# Altium project PCB_Project.PrjPcb
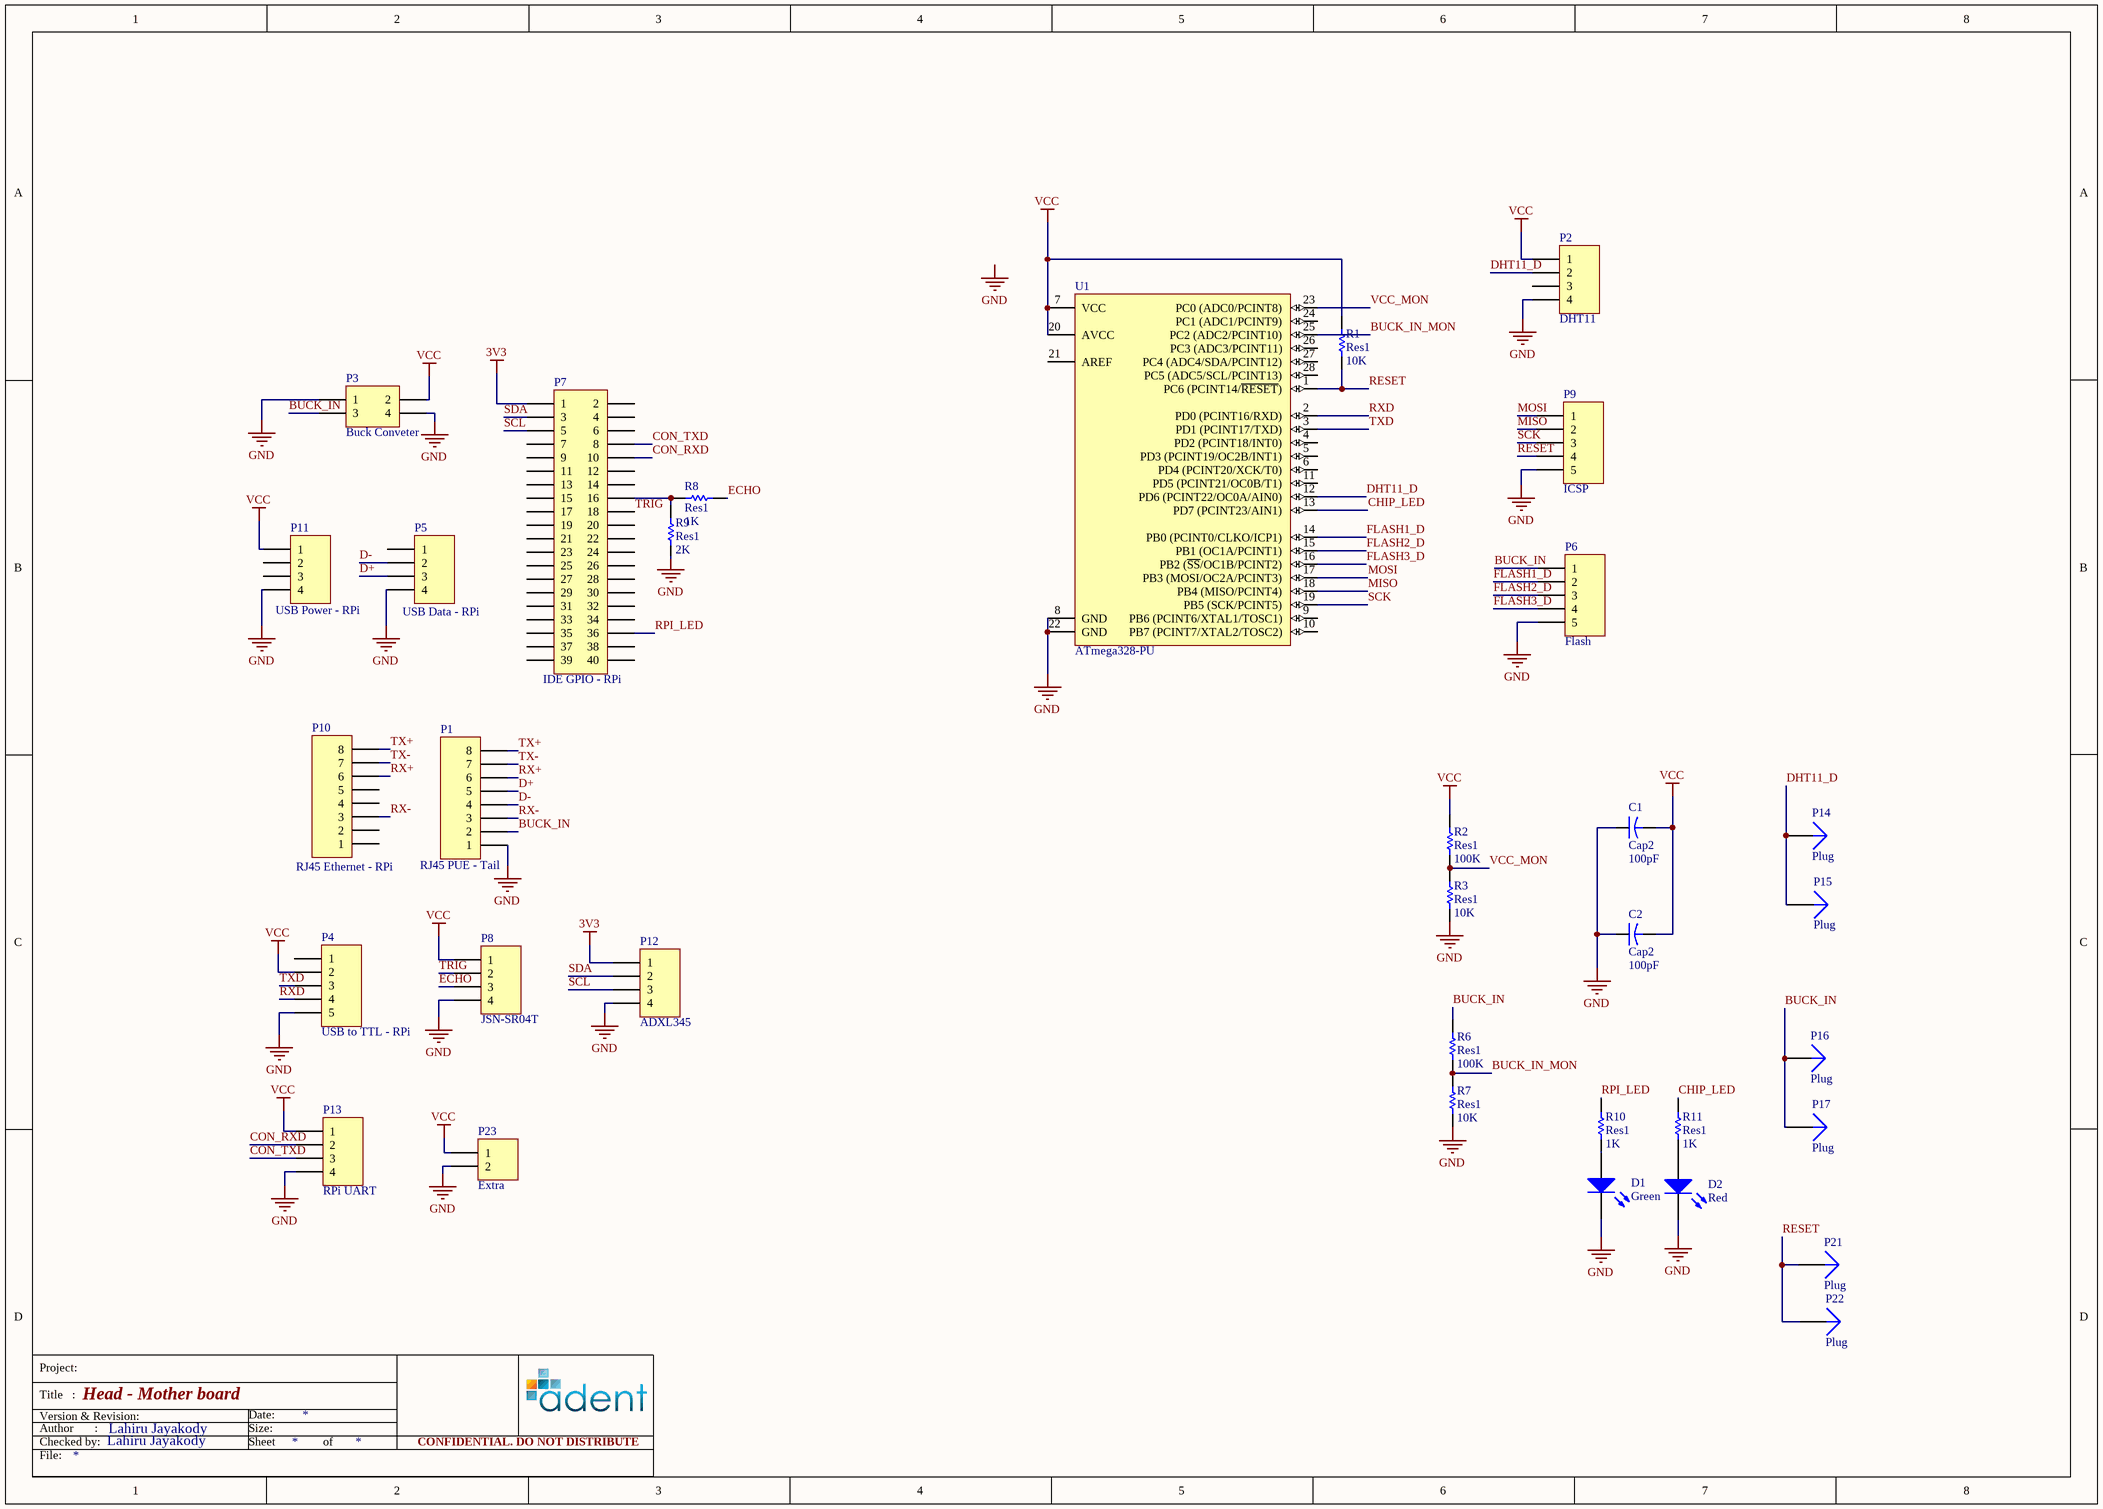
[diagram p0: HeadBoard.SchDoc]
1 sheet, 34 parts. Net scope: global (net labels, ports and power ports of the same name join across sheets).
Board file: HeadBoard.PcbDoc

## Sheet HeadBoard.SchDoc
size A3; SheetTitle: Head - Mother board; AuthorName: Lahiru Jayakody; CheckedByName: Lahiru Jayakody; PageSetup: Record=PageOptions|CenterHorizontal=True|CenterVertical=True|PrintScale=1.53|XCorrection=1.00|YCorrection=1.00|PrintKind=0|BorderSize=5000000|LeftOffset=0|BottomOffset=0|Orientation=1|PaperLength=1000|PaperWidth=1000|Scale=100|PaperSource=7|PrintQuality=-3|MediaType=1|DitherType=10|PrintScaleMode=1|PaperKind=B5 (JIS)|PaperIndex=13

### Parts
C1  Cap2  value 100pF  [CAPR5-4X5]
C2  Cap2  value 100pF  [CAPR5-4X5]
D1  Green  [LED-1]
D2  Red  [LED-1]
P1  RJ45 PUE - Tail  [RJ45]
P2  DHT11  [HDR1X4]
P3  Buck Conveter  [PWR_HEADER]
P4  USB to TTL - RPi  [HDR1X5]
P5  USB Data - RPi  [USB_Female]
P6  Flash  [HDR1X5]
P7  IDE GPIO - RPi  [HDR2X20]
P8  JSN-SR04T  [HDR1X4]
P9  ICSP  [HDR1X5]
P10  RJ45 Ethernet - RPi  [RJ45]
P11  USB Power - RPi  [USB_Female]
P12  ADXL345  [HDR1X4]
P13  RPi UART  [HDR1X4]
P14  Plug  [PIN1]
P15  Plug  [PIN1]
P16  Plug  [PIN1]
P17  Plug  [PIN1]
P21  Plug  [PIN1]
P22  Plug  [PIN1]
P23  Extra  [HDR1X2]
R1  Res1  value 10K  [AXIAL-0.3]
R2  Res1  value 100K  [AXIAL-0.3]
R3  Res1  value 10K  [AXIAL-0.3]
R6  Res1  value 100K  [AXIAL-0.3]
R7  Res1  value 10K  [AXIAL-0.3]
R8  Res1  value 1K  [AXIAL-0.3]
R9  Res1  value 2K  [AXIAL-0.3]
R10  Res1  value 1K  [AXIAL-0.3]
R11  Res1  value 1K  [AXIAL-0.3]
U1  ATmega328-PU  [28P3]

### Nets
3V3: P7.1 P12.1
GND: C1.1 C2.1 D1.2(K) D2.2(K) P1.1 P2.4 P3.1 P3.4 P4.5 P5.4 P6.5 P8.4 P9.5 P11.4 P12.4 P13.4 P23.2 R3.1 R7.1 R9.1 U1.8(GND) U1.22(GND)
VCC: C1.2 C2.2 P2.1 P3.2 P4.2 P8.1 P11.1 P13.1 P23.1 R1.2 R2.2 U1.7(VCC) U1.20(AVCC)
BUCK_IN: P1.2 P3.3 P6.1 P16.1 P17.1 R6.2
BUCK_IN_MON: R6.1 R7.2 U1.25(PC2_(ADC2/PCINT10))
CHIP_LED: R11.2 U1.13(PD7_(PCINT23/AIN1))
CON_RXD: P7.10 P13.2
CON_TXD: P7.8 P13.3
D+: P1.5 P5.3
D-: P1.4 P5.2
DHT11_D: P2.2 P14.1 P15.1 U1.12(PD6_(PCINT22/OC0A/AIN0))
ECHO: P8.3 R8.1
FLASH1_D: P6.2 U1.14(PB0_(PCINT0/CLKO/ICP1))
FLASH2_D: P6.3 U1.15(PB1_(OC1A/PCINT1))
FLASH3_D: P6.4 U1.16(PB2_(~{SS}/OC1B/PCINT2))
MISO: P9.2 U1.18(PB4_(MISO/PCINT4))
MOSI: P9.1 U1.17(PB3_(MOSI/OC2A/PCINT3))
RESET: P9.4 P21.1 P22.1 R1.1 U1.1(PC6_(PCINT14/~{RESET}))
RPI_LED: P7.36 R10.2
RX+: P1.6 P10.6
RX-: P1.3 P10.3
RXD: P4.4 U1.2(PD0_(PCINT16/RXD))
SCK: P9.3 U1.19(PB5_(SCK/PCINT5))
SCL: P7.5 P12.3
SDA: P7.3 P12.2
TRIG: P7.18 P8.2
TX+: P1.8 P10.8
TX-: P1.7 P10.7
TXD: P4.3 U1.3(PD1_(PCINT17/TXD))
VCC_MON: R2.1 R3.2 U1.23(PC0_(ADC0/PCINT8))
NetD1_1: D1.1(A) R10.1
NetD2_1: D2.1(A) R11.1
NetP7_16: P7.16 R8.2 R9.2

Not connected (* = marked no-connect by the designer): P2 3; P4 1; P5 1; P7 2 4 6 7 9 11 12 13 14 15 17 19 20 21 22 23 24 25 26 27 28 29 30 31 32 33 34 35 37 38 39 40; P10 1 2 4 5; P11 2 3; U1 4(PD2_(PCINT18/INT0)) 5(PD3_(PCINT19/OC2B/INT1)) 6(PD4_(PCINT20/XCK/T0)) 9(PB6_(PCINT6/XTAL1/TOSC1)) 10(PB7_(PCINT7/XTAL2/TOSC2)) 11(PD5_(PCINT21/OC0B/T1)) 21(AREF) 24(PC1_(ADC1/PCINT9)) 26(PC3_(ADC3/PCINT11)) 27(PC4_(ADC4/SDA/PCINT12)) 28(PC5_(ADC5/SCL/PCINT13))

### Notes on the sheet
- Labels drawn without touching a wire or pin: GND
- Project:
- Title   :
- Checked by:
- File:
- Version & Revision:
- Author       :
- Date:
- Sheet
- Size:
- of
- CONFIDENTIAL. DO NOT DISTRIBUTE

### Library data of the parts
C1 C2 = Cap2: Capacitor; Published: 23-Sep-2002; PackageReference: CAPR5-4X5; Publisher: Altium Limited; PackageDescription: Capacitor; 2 Leads
D1 D2 = LED1: Typical RED GaAs LED; Published: 8-Jun-2000; LatestRevisionDate: 08-Jul-2005; LatestRevisionNote: Mech Layer 1 removed.; PackageReference: LED-1; Publisher: Altium Limited; PackageDescription: LED; 2 Leads
P1 P10 = Header 8: Header, 8-Pin; LatestRevisionDate: 17-Jul-2002; LatestRevisionNote: Re-released for DXP Platform.; Publisher: Altium Limited
P2 P5 P8 P11-P13 = Header 4: Header, 4-Pin; LatestRevisionDate: 17-Jul-2002; LatestRevisionNote: Re-released for DXP Platform.; Publisher: Altium Limited
P3 = Header 2X2: Header, 2-Pin, Dual row; LatestRevisionDate: 17-Jul-2002; LatestRevisionNote: Re-released for DXP Platform.; Publisher: Altium Limited
P4 P6 P9 = Header 5: Header, 5-Pin; LatestRevisionDate: 17-Jul-2002; LatestRevisionNote: Re-released for DXP Platform.; Publisher: Altium Limited
P7 = Header 20X2: Header, 20-Pin, Dual row; LatestRevisionDate: 17-Jul-2002; LatestRevisionNote: Re-released for DXP Platform.; Publisher: Altium Limited
P23 = Header 2: Header, 2-Pin; LatestRevisionDate: 17-Jul-2002; LatestRevisionNote: Re-released for DXP Platform.; Publisher: Altium Limited
R1-R3 R6-R11 = Res1: Resistor; Published: 8-Jun-2000; LatestRevisionDate: 17-Jul-2002; LatestRevisionNote: Re-released for DXP Platform.; PackageReference: AXIAL-0.3; Publisher: Altium Limited; PackageDescription: Axial Device, Thru-Hole; 2 Leads; 0.3 in Pin Spacing
U1 = ATmega328-PU: 8-bit AVR Microcontroller, 32KB Flash, 1KB EEPROM, 2KB SRAM, 28-pin PDIP, Industrial Grade (-40°C to 85°C); Published: 1-Apr-2010; DatasheetVersion: revA, Jan-2010; PackageVersion: revB, Sep-2001; PackageReference: 28P3; Publisher: Altium Limited; PackageDescription: 28-lead (0.300"/7.62mm Wide) Plastic Dual Inline Package (PDIP); Supplier 1: Digi-Key; Supplier Part Number 1: ATMEGA328-PU-ND; Supplier 2: Mouser; Supplier Part Number 2: 556-ATMEGA328-PU; ComponentLink1Description: Manufacturer Link; ComponentLink1URL: http://www.atmel.com/products/avr/default.asp?; ComponentLink2Description: ATmega48A/48PA/88A/88PA/168A/168PA/328/328P Datasheet; ComponentLink2URL: http://www.atmel.com/dyn/resources/prod_documents/8271.pdf; ComponentLink3Description: ATmega48A/48PA/88A/88PA/168A/168PA/328/328P Summary; ComponentLink3URL: http://www.atmel.com/dyn/resources/prod_documents/8271S.pdf; ComponentLink4Description: Atmel.com Home; ComponentLink4URL: http://www.atmel.com
P14-P17 P21 P22 = Plug: LatestRevisionDate: 17-Jul-2002; LatestRevisionNote: Re-released for DXP Platform.; Publisher: Altium Limited